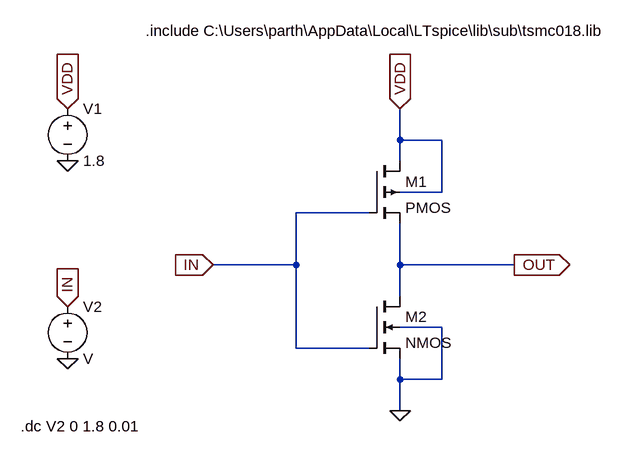
[diagram p0: schematic Part-B.asc]
Part-B.asc, the LTspice schematic file:
Version 4
SHEET 1 880 680
WIRE 240 16 240 -32
WIRE 304 16 240 16
WIRE 240 48 240 16
WIRE 304 96 304 16
WIRE 304 96 240 96
WIRE 192 128 80 128
WIRE 80 208 80 128
WIRE 80 208 -48 208
WIRE 240 208 240 144
WIRE 416 208 240 208
WIRE 240 256 240 208
WIRE 304 304 240 304
WIRE 80 336 80 208
WIRE 192 336 80 336
WIRE 240 384 240 352
WIRE 304 384 304 304
WIRE 304 384 240 384
WIRE 240 432 240 384
FLAG 240 432 0
FLAG -48 208 IN
IOPIN -48 208 In
FLAG 416 208 OUT
IOPIN 416 208 Out
FLAG 240 -32 VDD
IOPIN 240 -32 In
FLAG -272 48 0
FLAG -272 352 0
FLAG -272 -32 VDD
IOPIN -272 -32 In
FLAG -272 272 IN
IOPIN -272 272 In
SYMBOL nmos4 192 256 R0
SYMATTR InstName M2
SYMATTR Value2 l=0.3204u
SYMBOL pmos4 192 48 R0
SYMATTR InstName M1
SYMATTR Value2 l=0.3204u w=17.8u
SYMBOL voltage -272 -48 R0
WINDOW 123 0 0 Left 0
WINDOW 39 0 0 Left 0
SYMATTR InstName V1
SYMATTR Value 1.8
SYMBOL voltage -272 256 R0
SYMATTR InstName V2
TEXT -152 -152 Left 2 !.include C:\\Users\\parth\\AppData\\Local\\LTspice\\lib\\sub\\tsmc018.lib
TEXT -344 456 Left 2 !.dc V2 0 1.8 0.01

The netlist it stands for:
* Part-B.asc
M2 OUT IN 0 0 NMOS l=0.3204u
M1 VDD IN OUT VDD PMOS l=0.3204u w=17.8u
V1 VDD 0 1.8
V2 IN 0 V
.model NMOS NMOS
.model PMOS PMOS
.lib standard.mos
.include C:\Users\parth\AppData\Local\LTspice\lib\sub\tsmc018.lib
.dc V2 0 1.8 0.01
.backanno
.end

* Results of the author's LTspice run, read from the files saved beside the schematic
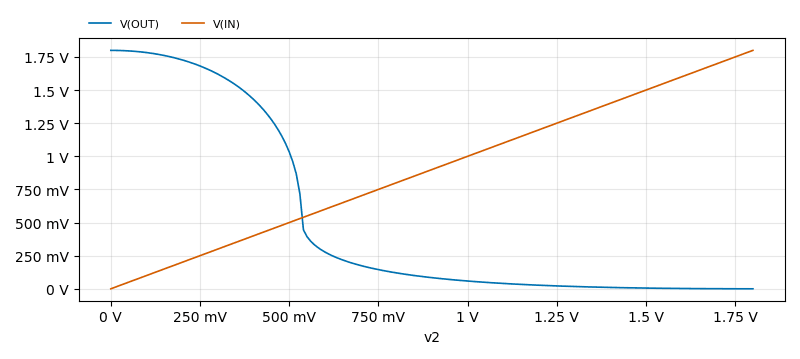
[diagram p1: DC transfer characteristic of Part-B.asc, plotted from the saved traces]
* DC transfer characteristic, 1 run:
*   V(OUT): 1.8 V at v2=0 V, 293.2 pV at v2=1.8 V, min 293.2 pV, max 1.8 V
*   V(IN): 0 V at v2=0 V, 1.8 V at v2=1.8 V, min 0 V, max 1.8 V